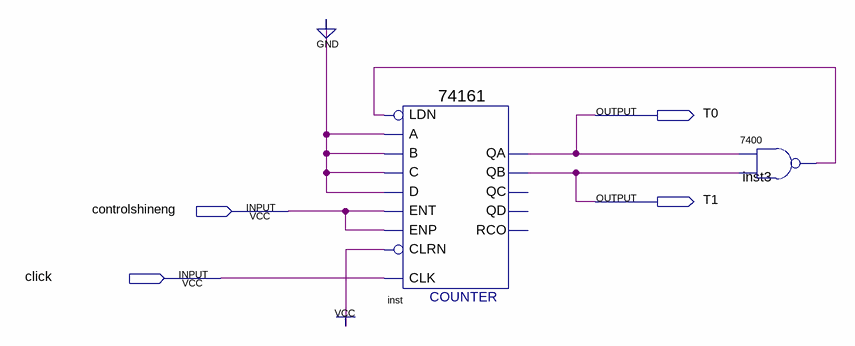
[diagram p0: schematic sheet]
// Quartus schematic mo4 control.bdf as structural Verilog: 2 symbols, 4 pins
module \mo4_control  (
  input  controlshineng,
  input  click,
  output T0,
  output T1
);

  wire inst3_1;

  \74161  inst (
    .CLRN(1'b1), .CLK(click), .ENP(controlshineng), .LDN(inst3_1), .A(1'b0), .D(1'b0), .ENT(controlshineng),
    .B(1'b0), .C(1'b0), .QB(T1), .QA(T0));  // open: QD, QC, RCO
  \7400  inst3 (.\3 (T1), .\2 (T0), .\1 (inst3_1));
endmodule
